# EAGLE design 18f4550 (EAGLE 5.11)
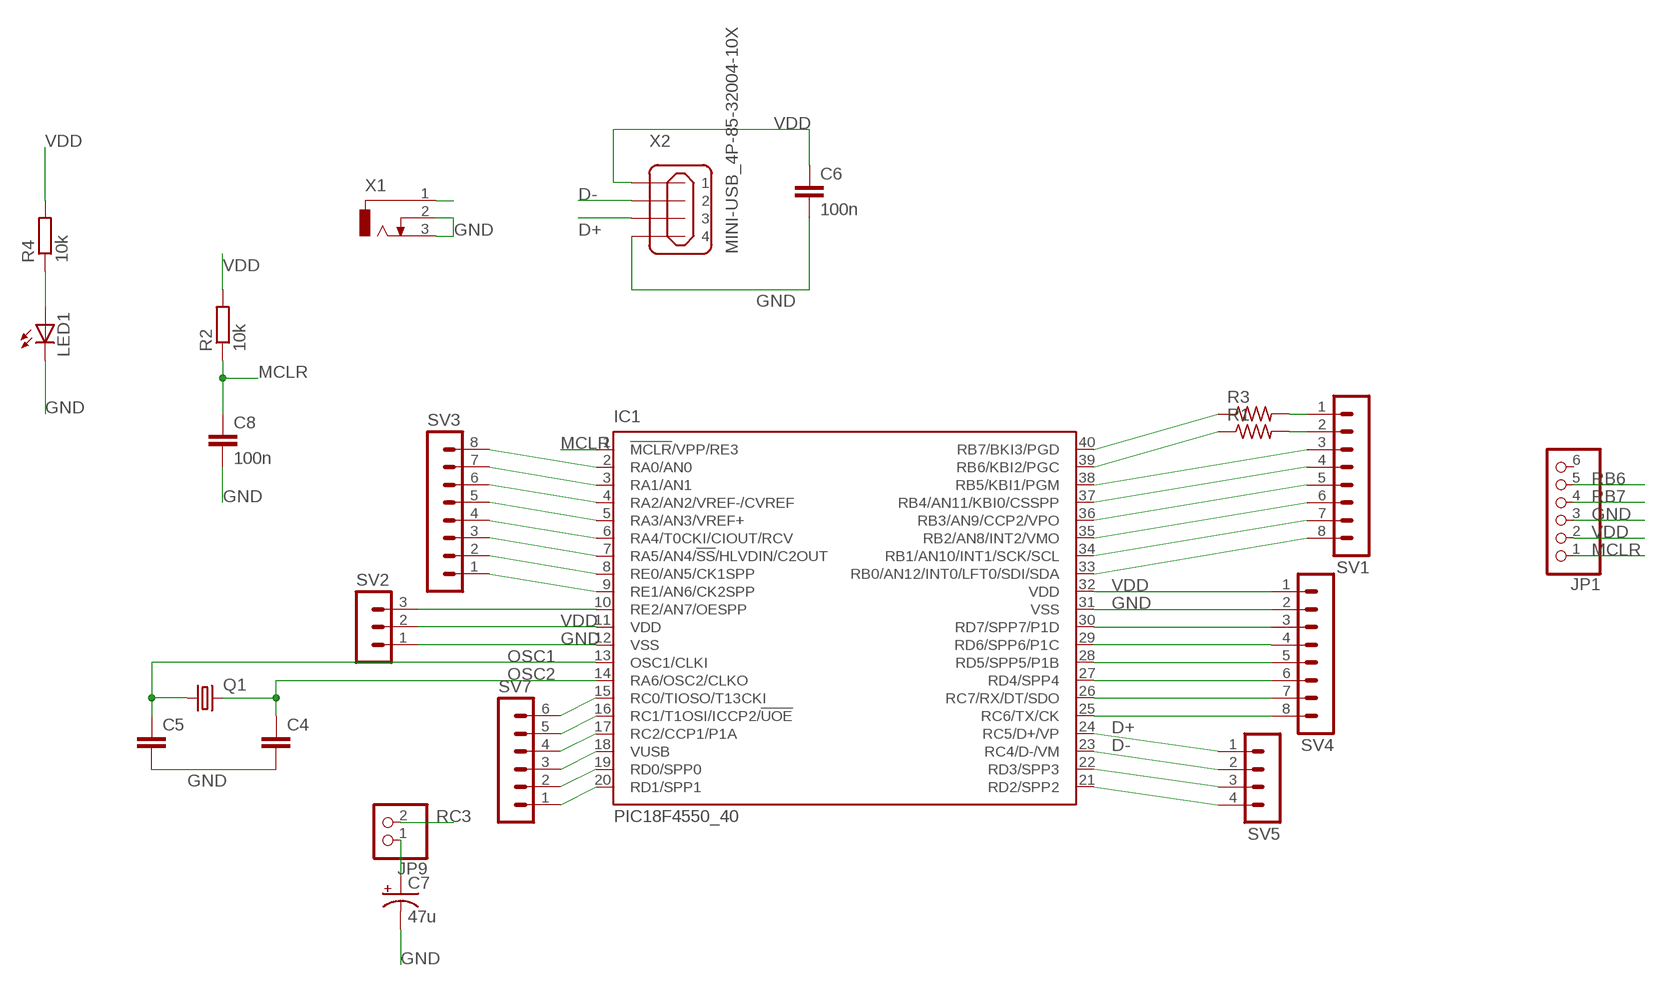
[diagram p0: schematic, sheet 1]

## Parts
C4  C-EUC0402  [C0402]
C5  C-EUC0402  [C0402]
C6  100n  C-EUC0402  [C0402]
C7  47u  CPOL-USTT2D5L  [TT2D5L]
C8  100n  C-EUC0402  [C0402]
IC1  PIC18F4550_40  [DIL40]
JP1  PINHD-1X6  [1X06]
JP9  PINHD-1X2  [1X02]
LED1  LEDCHIP-LED0603  [CHIP-LED0603]
Q1  CRYSTALHC49S  [HC49/S]
R1  R-US_R0402  [R0402]
R2  10k  R-EU_R0402  [R0402]
R3  R-US_R0402  [R0402]
R4  10k  R-EU_R0402  [R0402]
SV1  MA08-1  [MA08-1]
SV2  MA03-1  [MA03-1]
SV3  MA08-1  [MA08-1]
SV4  MA08-1  [MA08-1]
SV5  MA04-1  [MA04-1]
SV7  MA06-1  [MA06-1]
X1  DCJ0202  [DCJ0202]
X2  MINI-USB_4P-85-32004-10X  [85-32004-10X]

## Nets
D+: IC1.24(RC5/D+/VP) SV5.1 X2.3
D-: IC1.23(RC4/D-/VM) SV5.2 X2.2
GND: C4.2 C5.2 C6.2 C7.- C8.2 IC1.12(VSS) IC1.31(VSS) JP1.3 LED1.C SV2.1 SV4.2 X1.2 X1.3 X2.4
MCLR: C8.1 IC1.1(!MCLR!/VPP/RE3) JP1.1 R2.1
N$1: R3.2 SV1.1
N$2: R1.2 SV1.2
N$3: IC1.38(RB5/KBI1/PGM) SV1.3
N$4: IC1.37(RB4/AN11/KBI0/CSSPP) SV1.4
N$5: IC1.36(RB3/AN9/CCP2/VPO) SV1.5
N$6: IC1.35(RB2/AN8/INT2/VMO) SV1.6
N$7: IC1.34(RB1/AN10/INT1/SCK/SCL) SV1.7
N$8: IC1.33(RB0/AN12/INT0/LFT0/SDI/SDA) SV1.8
N$9: IC1.30(RD7/SPP7/P1D) SV4.3
N$10: IC1.29(RD6/SPP6/P1C) SV4.4
N$11: IC1.28(RD5/SPP5/P1B) SV4.5
N$12: IC1.27(RD4/SPP4) SV4.6
N$13: IC1.2(RA0/AN0) SV3.8
N$14: IC1.3(RA1/AN1) SV3.7
N$15: IC1.4(RA2/AN2/VREF-/CVREF) SV3.6
N$16: IC1.5(RA3/AN3/VREF+) SV3.5
N$17: IC1.6(RA4/T0CKI/CIOUT/RCV) SV3.4
N$18: IC1.7(RA5/AN4/!SS!/HLVDIN/C2OUT) SV3.3
N$19: IC1.10(RE2/AN7/OESPP) SV2.3
N$20: IC1.9(RE1/AN6/CK2SPP) SV3.1
N$21: IC1.8(RE0/AN5/CK1SPP) SV3.2
N$24: IC1.21(RD2/SPP2) SV5.4
N$25: IC1.22(RD3/SPP3) SV5.3
N$26: IC1.15(RC0/TIOSO/T13CKI) SV7.6
N$27: IC1.16(RC1/T1OSI/ICCP2/!UOE) SV7.5
N$28: IC1.17(RC2/CCP1/P1A) SV7.4
N$30: IC1.26(RC7/RX/DT/SDO) SV4.7
N$31: IC1.25(RC6/TX/CK) SV4.8
N$32: IC1.19(RD0/SPP0) SV7.2
N$33: IC1.20(RD1/SPP1) SV7.1
N$39: LED1.A R4.1
N$46: C7.+ JP9.1
OSC1: C5.1 IC1.13(OSC1/CLKI) Q1.1
OSC2: C4.1 IC1.14(RA6/OSC2/CLKO) Q1.2
RB6: IC1.39(RB6/KBI2/PGC) JP1.5 R1.1
RB7: IC1.40(RB7/BKI3/PGD) JP1.4 R3.1
RC3: IC1.18(VUSB) JP9.2 SV7.3
VDD: C6.1 IC1.11(VDD) IC1.32(VDD) JP1.2 R2.2 R4.2 SV2.2 SV4.1 X1.1 X2.1
Unconnected: JP1.6

## Library data of the parts
C4-C6 C8 = resistor:C-EU: CAPACITOR, European symbol
C7 = rcl:CPOL-US: POLARIZED CAPACITOR, American symbol
IC1 = microchip:PIC18F4*_40: USB Microcontrollers with nanoWatt Technology High-Performance, Enhanced Flash, 28/40/44-Pin, Source: http://ww1.microchip.com/downloads/en/devicedoc/39632c.pdf
JP1 = pinhead:PINHD-1X6: PIN HEADER
JP9 = pinhead:PINHD-1X2: PIN HEADER
LED1 = led:LED: LED OSRAM: - CHIPLED LG R971, LG N971, LY N971, LG Q971, LY Q971, LO R971, LY R971 LH N974, LH R974 LS Q976, LO Q976, LY Q976 LO Q996 - Hyper CHIPLED LW Q18S LB Q993, LB Q99A, LB R99A - SideLED LS A670, LO A670, LY A670, LG A670, LP A670 LB A673, LV A673, LT A673, LW A673 LH A674 LY A675 LS A676, LA A676, LO A676, LY A676, LW A676 LS A679, LY A679, LG A679 - Hyper Micro SIDELED® LS Y876, LA Y876, LO Y876, LY Y876 LT Y87S - SmartLED LW L88C, LW L88S LB L89C, LB L89S, LG L890 LS L89K, LO L89K, LY L89K LS L896, LA L896, LO L896, LY L896 - TOPLED LS T670, LO T670, LY T670, LG T670, LP T670 LSG T670, LSP T670, LSY T670, LOP T670, LYG T670 LG T671, LOG T671, LSG T671 LB T673, LV T673, LT T673, LW T673 LH T674 LS T676, LA T676, LO T676, LY T676, LB T676, LH T676, LSB T676, LW T676 LB T67C, LV T67C, LT T67C, LS T67K, LO T67K, LY T67K, LW E67C LS E67B, LA E67B, LO E67B, LY E67B, LB E67C, LV E67C, LT E67C LW T67C LS T679, LY T679, LG T679 LS T770, LO T770, LY T770, LG T770, LP T770 LB T773, LV T773, LT T773, LW T773 LH T774 LS E675, LA E675, LY E675, LS T675 LS T776, LA T776, LO T776, LY T776, LB T776 LHGB T686 LT T68C, LB T68C - Hyper Mini TOPLED® LB M676 - Mini TOPLED Santana® LG M470 LS M47K, LO M47K, LY M47K Source: http://www.osram.convergy.de LUXEON: - LUMILED® LXK2-PW12-R00, LXK2-PW12-S00, LXK2-PW14-U00, LXK2-PW14-V00 LXK2-PM12-R00, LXK2-PM12-S00, LXK2-PM14-U00 LXK2-PE12-Q00, LXK2-PE12-R00, LXK2-PE12-S00, LXK2-PE14-T00, LXK2-PE14-U00 LXK2-PB12-K00, LXK2-PB12-L00, LXK2-PB12-M00, LXK2-PB14-N00, LXK2-PB14-P00, LXK2-PB14-Q00 LXK2-PR12-L00, LXK2-PR12-M00, LXK2-PR14-Q00, LXK2-PR14-R00 LXK2-PD12-Q00, LXK2-PD12-R00, LXK2-PD12-S00 LXK2-PH12-R00, LXK2-PH12-S00 LXK2-PL12-P00, LXK2-PL12-Q00, LXK2-PL12-R00 Source: www.luxeon.com KINGBRIGHT: KA-3528ASYC Source: www.kingbright.com
Q1 = crystal:CRYSTAL: CRYSTAL
R1 R3 = resistor:R-US_: RESISTOR, American symbol
R2 R4 = resistor:R-EU_: RESISTOR, European symbol
SV1 SV3 SV4 = con-lstb:MA08-1: PIN HEADER; OC_FARNELL: unknown; OC_NEWARK: unknown
SV2 = con-lstb:MA03-1: PIN HEADER; OC_FARNELL: unknown; OC_NEWARK: unknown
SV5 = con-lstb:MA04-1: PIN HEADER; OC_FARNELL: unknown; OC_NEWARK: unknown
SV7 = con-lstb:MA06-1: PIN HEADER; OC_FARNELL: unknown; OC_NEWARK: unknown
X1 = con-jack:DCJ0202: DC POWER JACK Source: DCJ0202.pdf; OC_FARNELL: unknown; OC_NEWARK: unknown
X2 = con-cypressindustries:MINI-USB_4P-: MINI USB 4 Pol. Source: www.cypressindustries.com

## Board
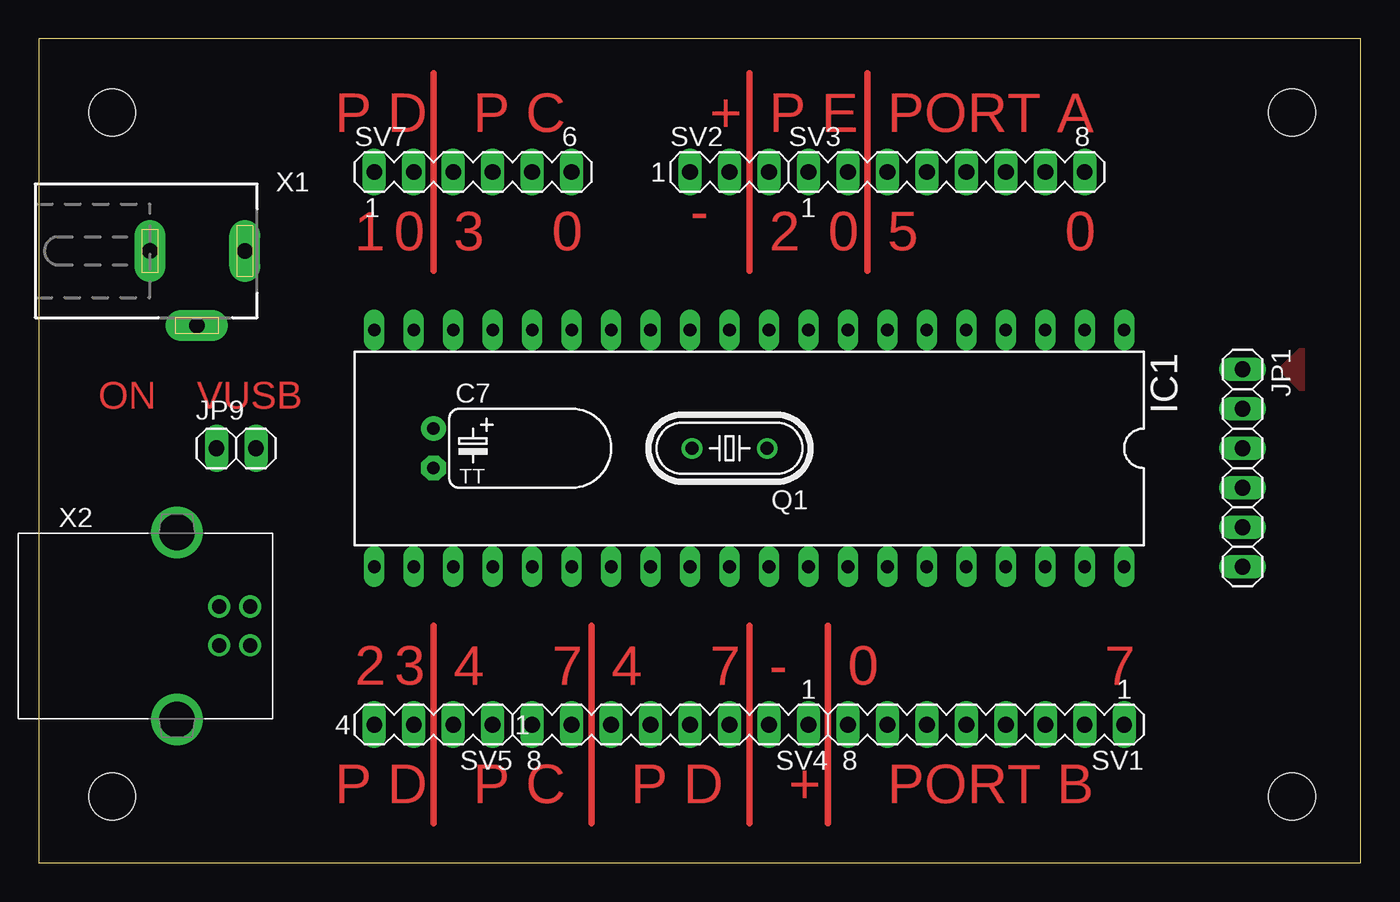
[diagram p1: board, top side]
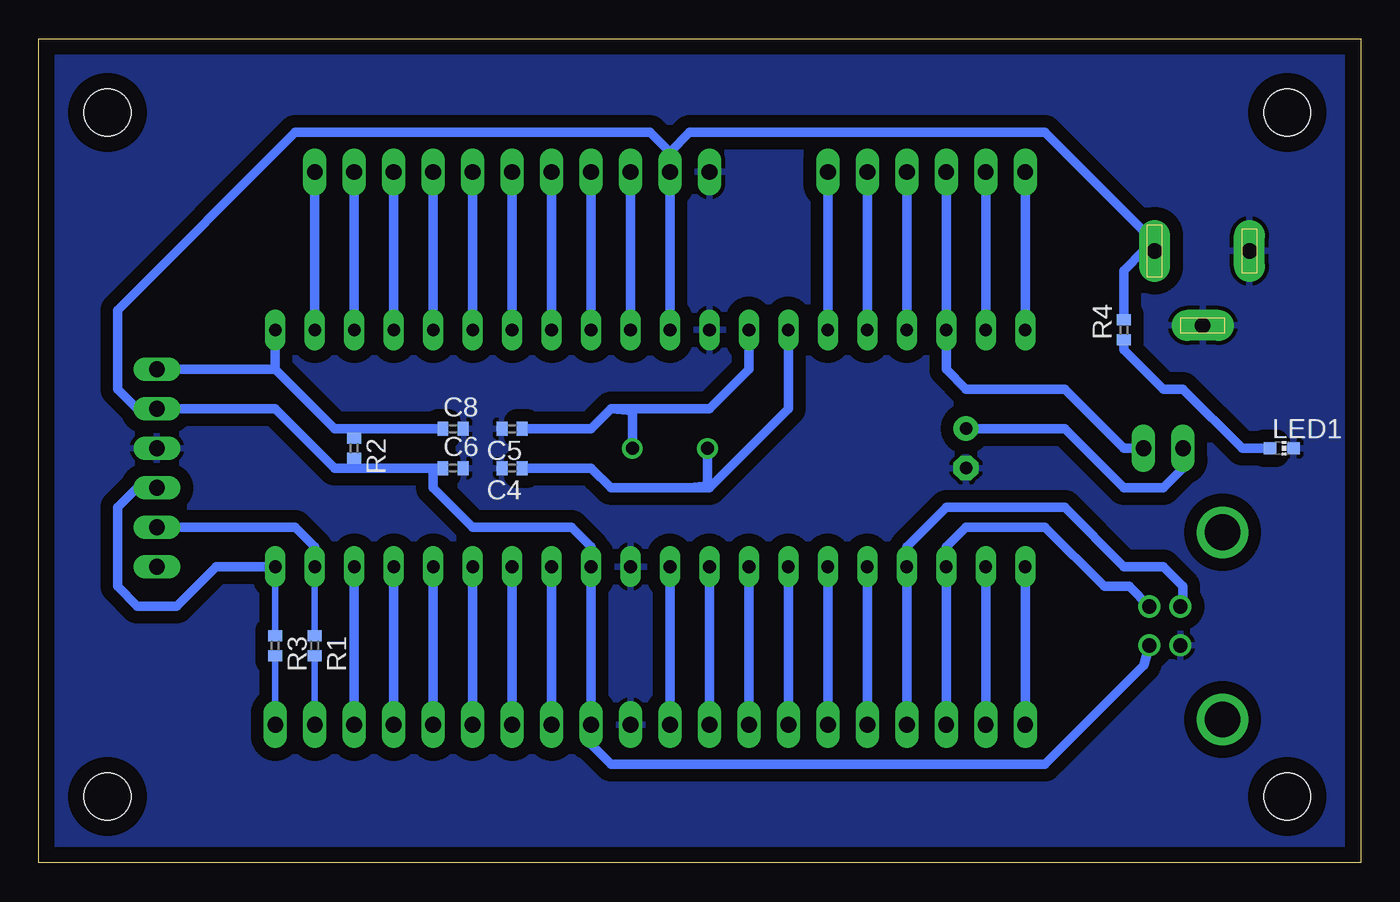
[diagram p2: board, bottom side, seen from below]

Size 85.07 x 53.01 mm. Coordinates in mm from the lower left corner, seen from the top.
Outline: 0,0 85.07,0 85.07,53.01 0,53.01 0,0
Copper layers (1*16): Top 0.035mm / dielectric 1.5mm / Bottom 0.035mm
Design rules "default": minimum track width 10mil, minimum drill 24mil, track to track 8mil, track to pad 8mil, pad to pad 8mil, via to via 8mil, smd to smd 8mil, copper to edge 40mil, drill to drill 8mil, minimum pad ring 10mil, minimum via ring 8mil, stop-mask expansion 4mil, vias tented up to drill 0mil, thermal gap 10mil
Holes 3 mm at 4.73,48.27 4.73,4.27 80.65,48.27 80.65,4.27

### Footprints (pad centres in the part's own frame; a part is rotated, then mirrored left to right if it is on the bottom)
C0402 = smd 0.7 x 0.9: 1 -0.65,0; 2 0.65,0
TT2D5L = drill 0.813 pad 1.6 round: + -1.27,0 | drill 0.813 pad 1.6 octagon: - 1.27,0
DIL40 = drill 0.813 long: 1 -24.13,-7.62; 2 -21.59,-7.62; 3 -19.05,-7.62; 4 -16.51,-7.62; 5 -13.97,-7.62; 6 -11.43,-7.62; 7 -8.89,-7.62; 8 -6.35,-7.62; 9 -3.81,-7.62; 10 -1.27,-7.62; 11 1.27,-7.62; 12 3.81,-7.62; 13 6.35,-7.62; 14 8.89,-7.62; 15 11.43,-7.62; 16 13.97,-7.62; 17 16.51,-7.62; 18 19.05,-7.62; 19 21.59,-7.62; 20 24.13,-7.62; 21 24.13,7.62; 22 21.59,7.62; 23 19.05,7.62; 24 16.51,7.62; 25 13.97,7.62; 26 11.43,7.62; 27 8.89,7.62; 28 6.35,7.62; 29 3.81,7.62; 30 1.27,7.62; 31 -1.27,7.62; 32 -3.81,7.62; 33 -6.35,7.62; 34 -8.89,7.62; 35 -11.43,7.62; 36 -13.97,7.62; 37 -16.51,7.62; 38 -19.05,7.62; 39 -21.59,7.62; 40 -24.13,7.62
1X06 = drill 1.016 long: 1 -6.35,0; 2 -3.81,0; 3 -1.27,0; 4 1.27,0; 5 3.81,0; 6 6.35,0
1X02 = drill 1.016 long: 1 -1.27,0; 2 1.27,0
CHIP-LED0603 = smd 0.8 x 0.8: A 0,-0.75; C 0,0.75
HC49/S = drill 0.813 round: 1 -2.413,0; 2 2.413,0
R0402 = smd 0.7 x 0.9: 1 -0.65,0; 2 0.65,0
MA08-1 = drill 1.016 long: 1 -8.89,0; 2 -6.35,0; 3 -3.81,0; 4 -1.27,0; 5 1.27,0; 6 3.81,0; 7 6.35,0; 8 8.89,0
MA03-1 = drill 1.016 long: 1 -2.54,0; 2 0,0; 3 2.54,0
MA04-1 = drill 1.016 long: 1 -3.81,0; 2 -1.27,0; 3 1.27,0; 4 3.81,0
MA06-1 = drill 1.016 long: 1 -6.35,0; 2 -3.81,0; 3 -1.27,0; 4 1.27,0; 5 3.81,0; 6 6.35,0
DCJ0202 = drill 1 pad 2 long: 1 0,3.1; 2 4.8,0; 3 0,-3
85-32004-10X = drill 0.92 pad 1.27 round: 1 4.71,-1.25; 2 4.71,1.25; 3 2.71,1.25; 4 2.71,-1.25 | drill 2.3 pad 3 round: M1 0,6.02; M2 0,-6.02

### Placement (x,y rotation side)
C4  54.61,25.4 180 bottom
C5  54.61,27.94 180 bottom
C6  58.42,25.4 0 bottom
C7  25.4,26.67 270 top
C8  58.42,27.94 0 bottom
IC1  45.72,26.67 180 top
JP1  77.47,25.4 270 top
JP9  12.7,26.67 0 top
LED1  5.08,26.67 270 bottom
Q1  44.45,26.67 180 top
R1  67.31,13.97 270 bottom
R2  64.77,26.67 270 bottom
R3  69.85,13.97 270 bottom
R4  15.24,34.29 90 bottom
SV1  60.96,8.89 180 top
SV2  44.45,44.45 0 top
SV3  58.42,44.45 0 top
SV4  40.64,8.89 180 top
SV5  25.4,8.89 180 top
SV7  27.94,44.45 0 top
X1  10.16,39.37 270 top
X2  8.89,15.24 0 top

### Tracks (layer width: path | path; a pad name or v marks a point on that pad's centre or on a via)
D+
  Bottom 0.61: SV5.1 IC1.24 29.21,20.32 26.67,22.86 19.05,22.86 15.24,19.05 12.7,19.05 11.43,17.78 11.43,16.66 X2.3
D-
  Bottom 0.61: SV5.2 IC1.23 26.67,20.32 25.4,21.59 20.32,21.59 16.51,17.78 14.89,17.78 X2.2
GND
  pour Bottom (isolate 0.813): 85.09,53.34 0,53.34 0,0 85.09,0
MCLR
  Bottom 0.61: 64.77,27.94 66.04,27.94 69.85,31.75 | 69.85,31.75 IC1.1 | 64.77,27.94 R2.1 | 69.85,31.75 JP1.1 | C8.1 64.77,27.94
N$1
  Bottom 0.406: SV1.1 R3.2
N$2
  Bottom 0.406: SV1.2 R1.2
N$3
  Bottom 0.61: SV1.3 IC1.38
N$4
  Bottom 0.61: SV1.4 IC1.37
N$5
  Bottom 0.61: SV1.5 IC1.36
N$6
  Bottom 0.61: SV1.6 IC1.35
N$7
  Bottom 0.61: SV1.7 IC1.34
N$8
  Bottom 0.61: SV1.8 IC1.33
N$9
  Bottom 0.61: SV4.3 IC1.30
N$10
  Bottom 0.61: SV4.4 IC1.29
N$11
  Bottom 0.61: SV4.5 IC1.28
N$12
  Bottom 0.61: SV4.6 IC1.27
N$13
  Bottom 0.61: IC1.2 SV3.8
N$14
  Bottom 0.61: IC1.3 SV3.7
N$15
  Bottom 0.61: IC1.4 SV3.6
N$16
  Bottom 0.61: IC1.5 SV3.5
N$17
  Bottom 0.61: IC1.6 SV3.4
N$18
  Bottom 0.61: IC1.7 SV3.3
N$19
  Bottom 0.61: IC1.10 SV2.3
N$20
  Bottom 0.61: IC1.9 SV3.1
N$21
  Bottom 0.61: IC1.8 SV3.2
N$22
  Top 0.406: 35.56,2.54 35.56,15.24
N$23
  pour Top: 80.01,31.75 81.28,30.48 81.28,33.02
N$24
  Bottom 0.61: SV5.4 IC1.21
N$25
  Bottom 0.61: SV5.3 IC1.22
N$26
  Bottom 0.61: IC1.15 SV7.6
N$27
  Bottom 0.61: IC1.16 SV7.5
N$28
  Bottom 0.61: IC1.17 SV7.4
N$29
  Top 0.406: 25.4,38.1 25.4,50.8
N$30
  Bottom 0.61: SV4.7 IC1.26
N$31
  Bottom 0.61: SV4.8 IC1.25
N$32
  Bottom 0.61: IC1.19 SV7.2
N$33
  Bottom 0.61: IC1.20 SV7.1
N$34
  Top 0.406: 53.34,38.1 53.34,50.8
N$35
  Top 0.406: 45.72,38.1 45.72,50.8
N$36
  Top 0.406: 50.8,2.54 50.8,15.24
N$37
  Top 0.406: 25.4,2.54 25.4,15.24
N$38
  Top 0.406: 45.72,2.54 45.72,15.24
N$39
  Bottom 0.61: R4.1 15.24,33.02 12.7,30.48 11.43,30.48 7.62,26.67 LED1.A
N$46
  Bottom 0.61: JP9.1 11.43,25.4 12.7,24.13 15.24,24.13 19.05,27.94 C7.+
OSC1
  Bottom 0.61: IC1.13 39.37,31.75 41.91,29.21 48.26,29.21 | 48.26,29.21 49.53,27.94 C5.1 | Q1.1 46.86,29.08 48.26,29.21
OSC2
  Bottom 0.61: IC1.14 36.83,29.21 41.91,24.13 43.18,24.13 | 43.18,24.13 48.26,24.13 49.53,25.4 C4.1 | Q1.2 42.04,24.26 43.18,24.13
RB6
  Bottom 0.406: R1.1 IC1.39
  Bottom 0.61: IC1.39 67.31,20.32 68.58,21.59 JP1.5
RB7
  Bottom 0.406: R3.1 IC1.40
  Bottom 0.61: IC1.40 73.66,19.05 76.2,16.51 78.74,16.51 80.01,17.78 80.01,22.86 78.74,24.13 JP1.4
RC3
  Bottom 0.61: SV7.3 IC1.18 26.67,31.75 25.4,30.48 19.05,30.48 15.24,26.67 JP9.2
VDD
  Bottom 0.61: IC1.11 SV2.2 44.45,45.72 | X2.1 13.95,12.72 20.32,6.35 48.26,6.35 49.53,7.62 SV4.1 IC1.32 49.53,20.32 50.8,21.59 57.15,21.59 59.69,24.13 59.69,25.4 | 64.77,25.4 66.04,25.4 69.85,29.21 JP1.2 78.74,29.21 80.01,30.48 80.01,35.56 68.58,46.99 45.72,46.99 44.45,45.72 | 64.77,25.4 R2.2 | 44.45,45.72 43.18,46.99 20.32,46.99 13.26,39.93 X1.1 13.97,39.37 15.24,38.1 R4.2 | 59.69,25.4 64.77,25.4 | 59.69,25.4 C6.1

### Text on the board
Top: P D | P C | + | P E | PORT A | - | 1 | 0 | 3 | 0 | 2 | 0 | 5 | 0 | ON | VUSB | 2 | 3 | 4 | 7 | 4 | 7 | - | 0 | 7 | P D | P C | P D | + | PORT B